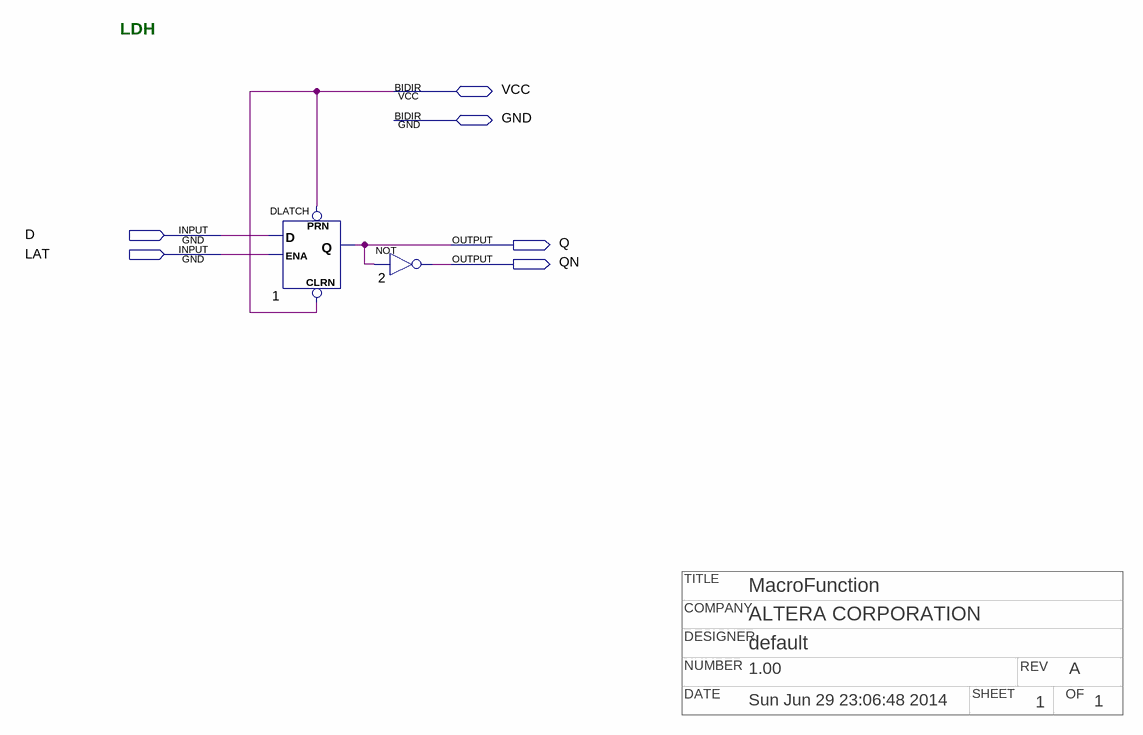
[diagram p0: schematic sheet]
// Quartus schematic npldh.bdf as structural Verilog: 2 symbols, 6 pins
// Title block: TITLE: MacroFunction; COMPANY: ALTERA CORPORATION; DESIGNER: default; NUMBER: 1.00; REV: A; DATE: Sun Jun 29 23:06:48 2014; SHEET: 1; OF: 1
module npldh (
  input  D,
  input  LAT,
  inout  VCC,
  inout  GND,
  output Q,
  output QN
);

  DLATCH u_1 (.CLRN(VCC), .D(D), .ENA(LAT), .PRN(VCC), .Q(Q));
  not u_2 (QN, Q);

  // Notes on the sheet:
  //   LDH
endmodule
